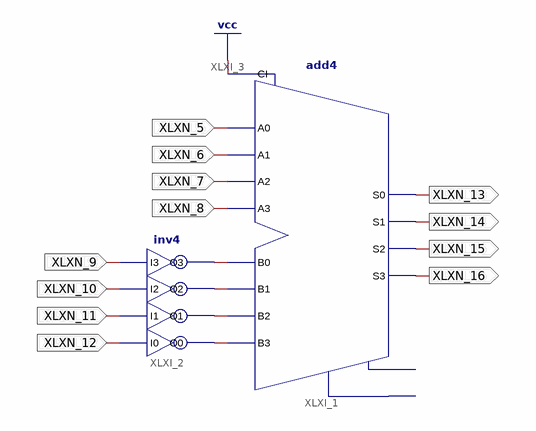
[diagram p0: schematic sheet 1]
// Xilinx ISE schematic testlab2.sch (spartan6) as structural Verilog: 2 symbols, 12 ports
module testlab2 (
  input  XLXN_5,
  input  XLXN_6,
  input  XLXN_7,
  input  XLXN_8,
  input  XLXN_9,
  input  XLXN_10,
  input  XLXN_11,
  input  XLXN_12,
  output XLXN_13,
  output XLXN_14,
  output XLXN_15,
  output XLXN_16
);

  wire XLXN_1, XLXN_2, XLXN_3, XLXN_4;

  add4 XLXI_1 (
    .A0(XLXN_5), .A1(XLXN_6), .A2(XLXN_7), .A3(XLXN_8), .B0(XLXN_4), .B1(XLXN_3), .B2(XLXN_2), .B3(XLXN_1),
    .CI(1'b1), .S0(XLXN_13), .S1(XLXN_14), .S2(XLXN_15), .S3(XLXN_16));  // open: CO, OFL
  inv4 XLXI_2 (
    .I0(XLXN_12), .I1(XLXN_11), .I2(XLXN_10), .I3(XLXN_9), .O0(XLXN_1), .O1(XLXN_2), .O2(XLXN_3), .O3(XLXN_4));
endmodule
